# EAGLE design My Arduino Nano2 interface2 (EAGLE 5.10)
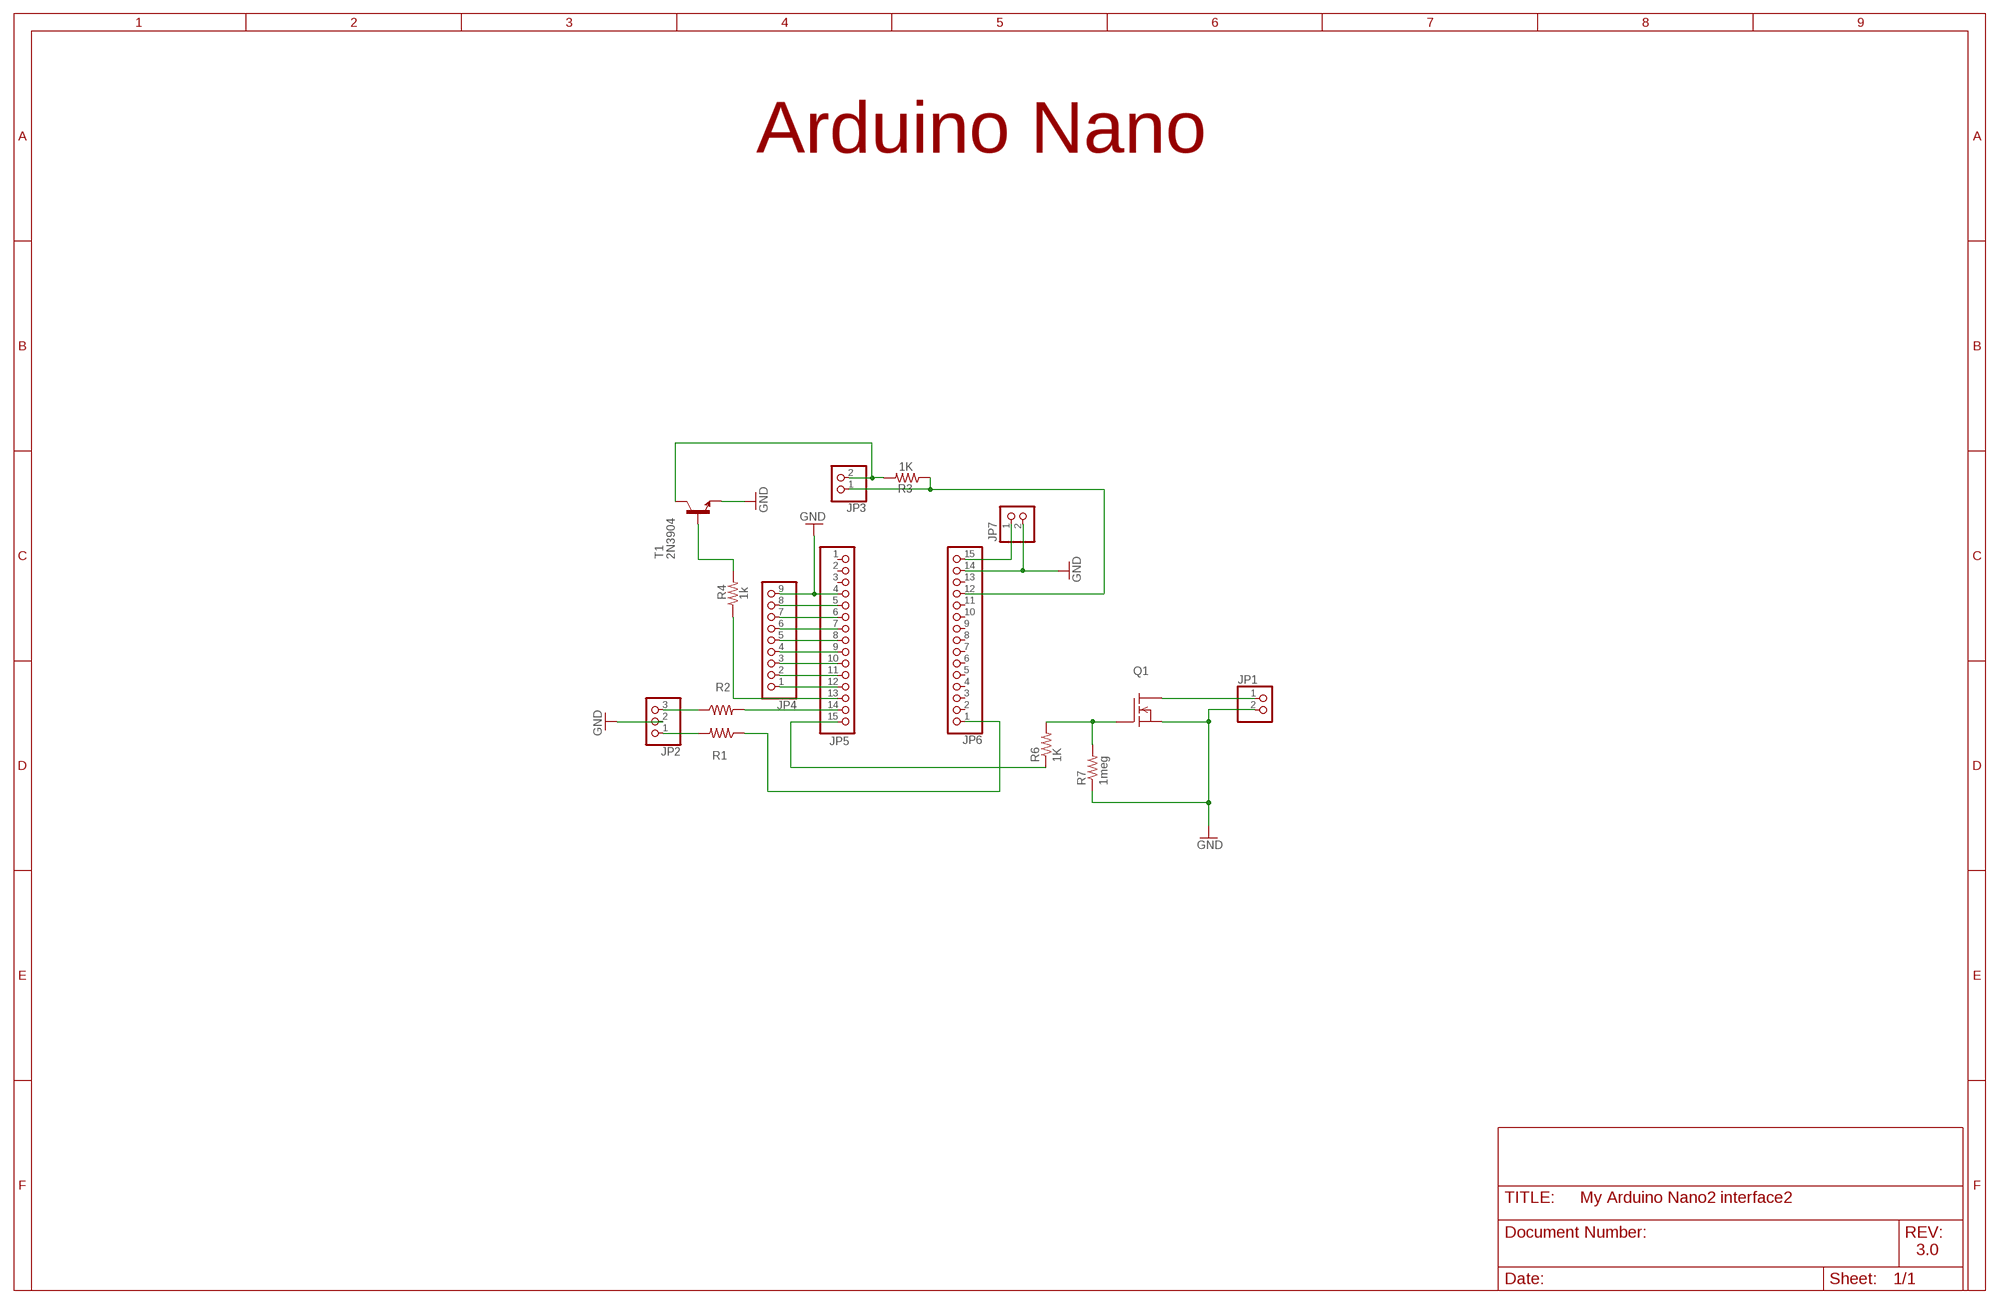
[diagram p0: schematic, sheet 1]

## Parts
JP1  PINHD-1X2  [1X02]
JP2  PINHD-1X3  [1X03]
JP3  PINHD-1X2  [1X02]
JP4  PINHD-1X9  [1X09]
JP5  PINHD-1X15  [1X15]
JP6  PINHD-1X15  [1X15]
JP7  PINHD-1X2  [1X02]
Q1  TN0602N3  [TO-92]
R1  R-US_0207/10  [0207/10]
R2  R-US_0207/10  [0207/10]
R3  1K  R-US_0207/10  [0207/10]
R4  1k  R-US_0207/10  [0207/10]
R6  1K  R-US_0207/10  [0207/10]
R7  1meg  R-US_0207/10  [0207/10]
T1  2N3904  [TO92]

## Nets
GND: JP1.2 JP2.2 JP4.9 JP5.4 JP6.14 JP7.2 Q1.1(S) R7.1 T1.3(E)
N$1: JP1.1 Q1.3(D)
N$2: JP2.3 R2.1
N$3: JP2.1 R1.2
N$4: JP6.1 R1.1
N$5: JP5.14 R2.2
N$6: R4.2 T1.2(B)
N$7: JP5.15 R6.1
N$8: Q1.2(G) R6.2 R7.2
N$9: JP3.1 JP6.12 R3.1
N$10: JP3.2 R3.2 T1.1(C)
N$11: JP5.13 R4.1
N$13: JP4.1 JP5.12
N$14: JP4.2 JP5.11
N$15: JP4.3 JP5.10
N$16: JP4.4 JP5.9
N$17: JP4.5 JP5.8
N$18: JP4.6 JP5.7
N$19: JP4.7 JP5.6
N$20: JP4.8 JP5.5
N$22: JP6.15 JP7.1
Unconnected: JP5.1 JP5.2 JP5.3 JP6.2 JP6.3 JP6.4 JP6.5 JP6.6 JP6.7 JP6.8 JP6.9 JP6.10 JP6.11 JP6.13

## Notes on the sheet
- Arduino Nano
- 3.0

## Library data of the parts
JP1 JP3 JP7 = pinhead:PINHD-1X2: PIN HEADER
JP2 = pinhead:PINHD-1X3: PIN HEADER
JP4 = pinhead:PINHD-1X9: PIN HEADER
JP5 JP6 = pinhead:PINHD-1X15: PIN HEADER
Q1 = transistor-fet:TN0602N3: N-Channel Enhancement MOSFET 20V; 4A; 0,75Ohm
R1-R4 R6 R7 = rcl:R-US_: RESISTOR, American symbol
T1 = transistor-neu-to92:2N3904: NPN TRANSISTOR

## Board
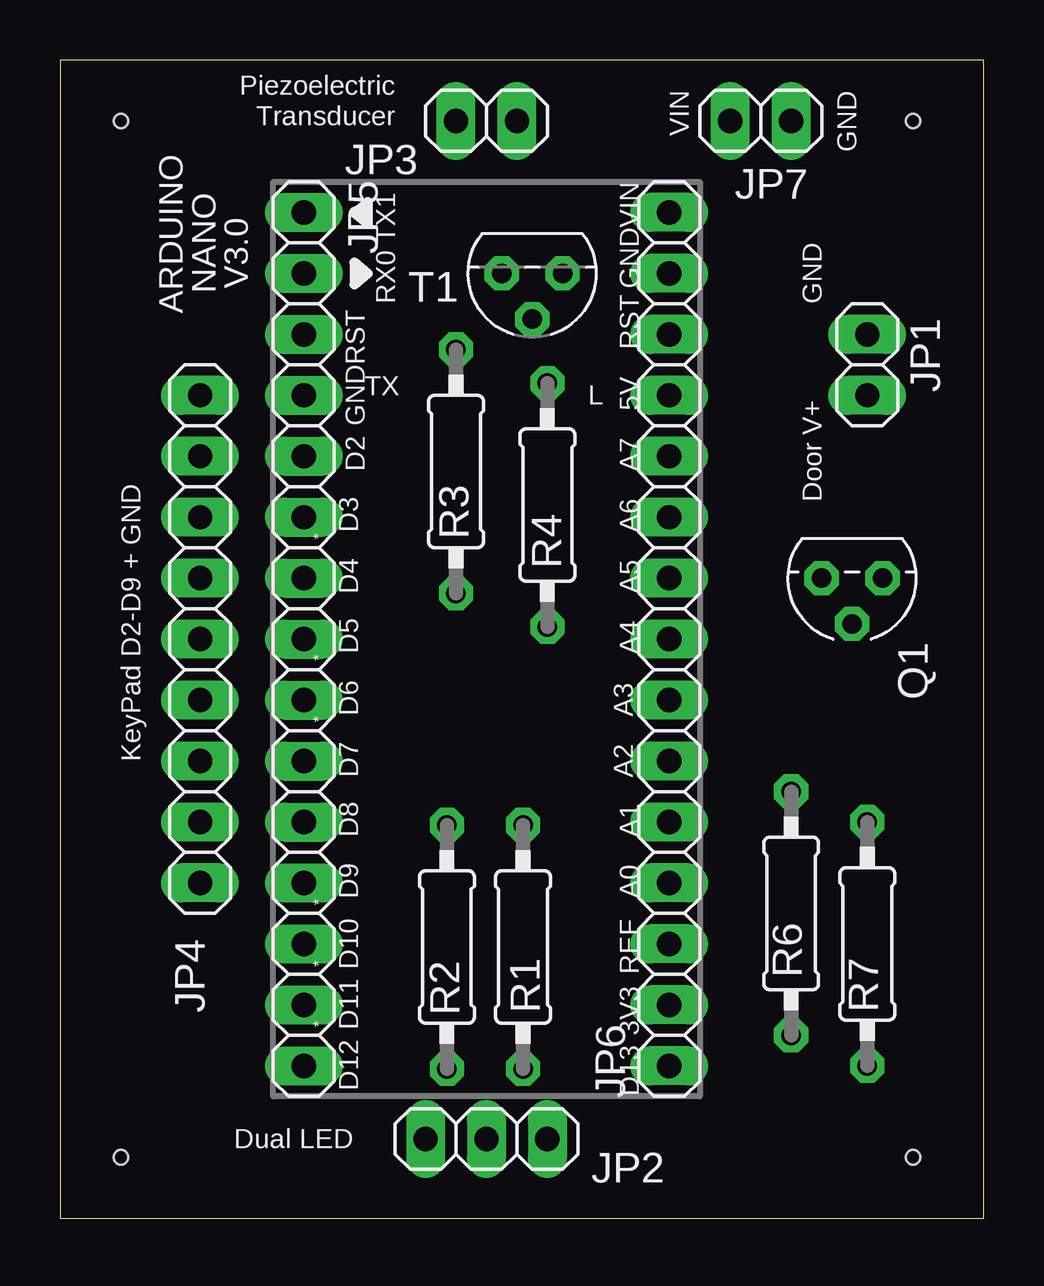
[diagram p1: board, top side]
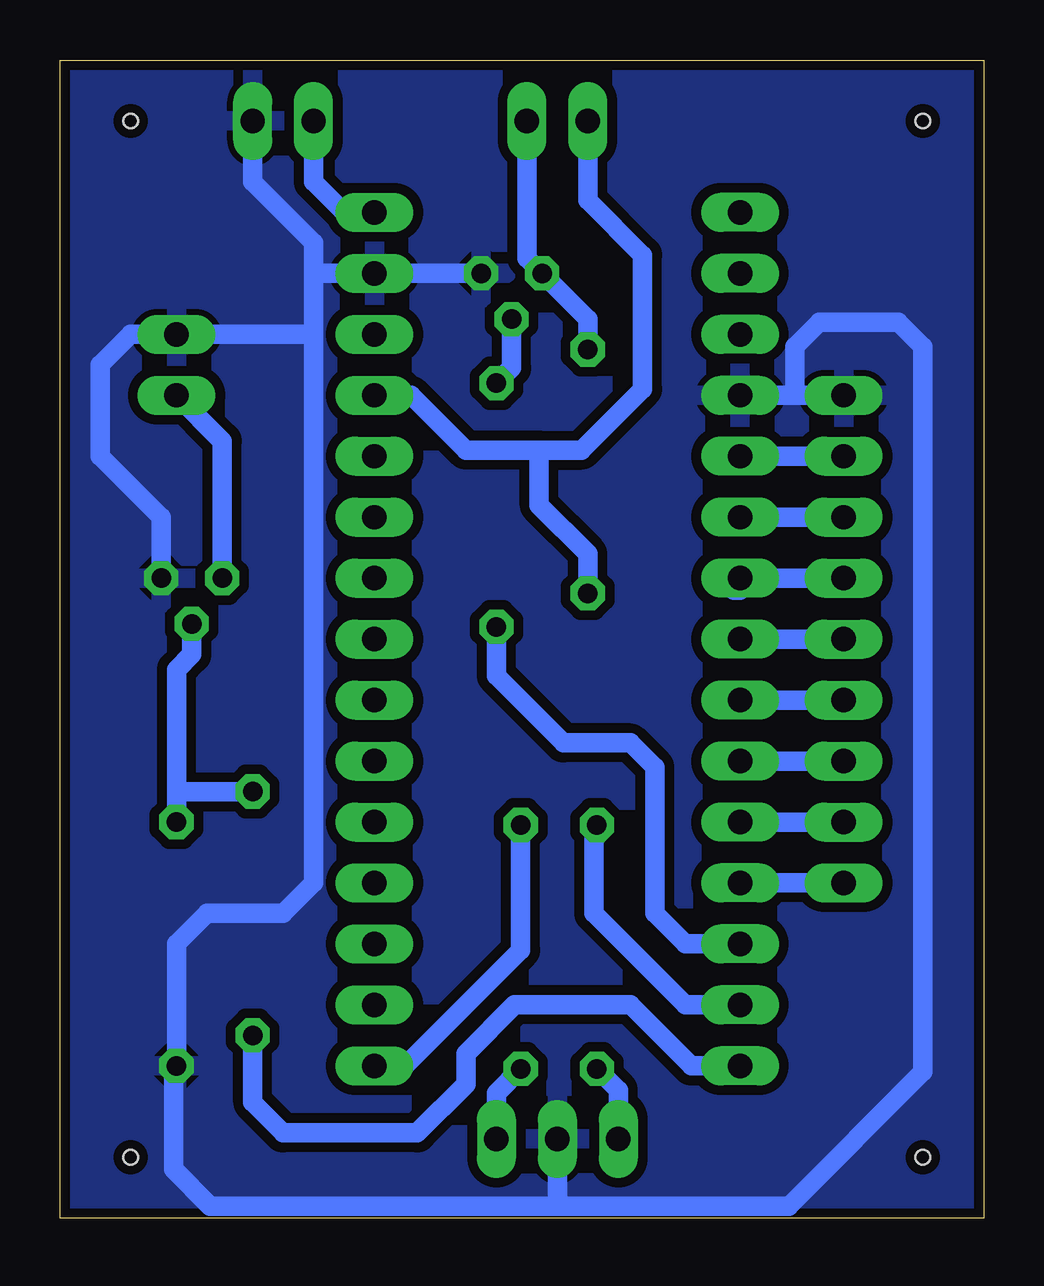
[diagram p2: board, bottom side, seen from below]

Size 38.51 x 48.26 mm. Coordinates in mm from the lower left corner, seen from the top.
Outline: 0,0 38.51,0 38.51,48.26 0,48.26 0,0
Copper layers (1*16): Top 0.035mm / dielectric 1.5mm / Bottom 0.035mm
Design rules "default *": minimum track width 8mil, minimum drill 16mil, track to track 8mil, track to pad 8mil, pad to pad 8mil, via to via 8mil, smd to smd 8mil, copper to edge 8mil, drill to drill 8mil, minimum pad ring 12mil, minimum via ring 8mil, stop-mask expansion 4mil, vias tented up to drill 18mil, thermal gap 10mil
Holes 0.6 mm at 2.54,45.72 2.54,2.54 35.56,2.54 35.56,45.72

### Footprints (pad centres in the part's own frame; a part is rotated, then mirrored left to right if it is on the bottom)
1X02 = drill 1.016 long: 1 -1.27,0; 2 1.27,0
1X03 = drill 1.016 long: 1 -2.54,0; 2 0,0; 3 2.54,0
1X09 = drill 1.016 long: 1 -10.16,0; 2 -7.62,0; 3 -5.08,0; 4 -2.54,0; 5 0,0; 6 2.54,0; 7 5.08,0; 8 7.62,0; 9 10.16,0
1X15 = drill 1.016 long: 1 -17.78,0; 2 -15.24,0; 3 -12.7,0; 4 -10.16,0; 5 -7.62,0; 6 -5.08,0; 7 -2.54,0; 8 0,0; 9 2.54,0; 10 5.08,0; 11 7.62,0; 12 10.16,0; 13 12.7,0; 14 15.24,0; 15 17.78,0
TO-92 = drill 0.813 octagon: 1 -1.27,0; 2 0,1.905; 3 1.27,0
0207/10 = drill 0.813 octagon: 1 -5.08,0; 2 5.08,0
TO92 = drill 0.813 octagon: 1 1.27,0; 2 0,1.905; 3 -1.27,0

### Placement (x,y rotation side)
JP1  33.66,35.56 90 top
JP2  17.78,3.3 180 top
JP3  17.78,45.72 0 top
JP4  5.84,24.13 90 top
JP5  10.16,24.13 270 top
JP6  25.4,24.13 90 top
JP7  29.21,45.72 0 top
Q1  33.02,26.67 180 top
R1  19.3,11.3 270 top
R2  16.13,11.3 90 top
R3  16.51,31.11 90 top
R4  20.32,29.72 90 top
R6  30.48,12.7 90 top
R7  33.66,11.43 90 top
T1  19.68,39.37 180 top

### Tracks (layer width: path | path; a pad name or v marks a point on that pad's centre or on a via)
GND
  Bottom 0.813: T1.3 JP6.14 27.94,39.37 | JP7.2 30.48,43.18 27.94,40.64 27.94,39.37 | 27.94,36.83 27.94,13.97 29.21,12.7 32.38,12.7 33.66,11.43 R7.1 33.78,6.22 33.78,2.03 32.26,0.51 17.53,0.51 | 27.94,36.83 JP1.2 35.56,36.83 36.83,35.56 36.83,31.75 34.29,29.21 Q1.1 | 27.94,36.83 27.94,39.37 | 7.87,34.29 JP4.9 | 7.87,34.29 JP5.4 | 7.87,34.29 7.87,36.32 6.86,37.34 3.56,37.34 2.54,36.32 2.54,6.1 8.13,0.51 17.53,0.51 | JP2.2 17.78,0.76 17.53,0.51
  pour Bottom (isolate 0.406): 0.51,48.26 38.61,48.26 38.61,-0.51 0.25,-0.51 0.25,48.26
N$1
  Bottom 0.813: Q1.3 31.75,32.38 JP1.1
N$2
  Bottom 0.813: JP2.3 15.24,5.33 R2.1
N$3
  Bottom 0.813: JP2.1 20.32,5.21 R1.2
N$4
  Bottom 0.813: R1.1 19.3,11.18 24.13,6.35 JP6.1
N$5
  Bottom 0.813: JP5.14 12.45,8.89 16.26,12.7 16.26,16.26 R2.2
N$6
  Bottom 0.813: T1.2 19.68,35.43 R4.2
N$7
  Bottom 0.813: JP5.15 12.19,6.35 14.73,8.89 19.56,8.89 21.59,6.86 21.59,5.59 23.62,3.56 29.21,3.56 30.48,4.83 R6.1
N$8
  Bottom 0.813: Q1.2 33.02,23.5 33.66,22.86 33.66,17.78 | R7.2 33.66,17.78 | 33.66,17.78 R6.2
N$9
  Bottom 0.813: JP3.1 16.51,42.42 14.22,40.13 14.22,34.54 16.76,32 18.54,32 | 18.54,32 21.59,32 23.88,34.29 JP6.12 | R3.1 16.51,27.69 18.54,29.72 18.54,32
N$10
  Bottom 0.813: JP3.2 19.05,40.01 T1.1 16.51,37.47 R3.2
N$11
  Bottom 0.813: JP5.13 12.45,11.43 13.72,12.7 13.72,18.8 14.73,19.81 17.53,19.81 20.32,22.61 R4.1
N$13
  Bottom 0.813: JP4.1 JP5.12
N$14
  Bottom 0.813: JP4.2 JP5.11
N$15
  Bottom 0.813: JP4.3 JP5.10
N$16
  Bottom 0.813: JP4.4 JP5.9
N$17
  Bottom 0.813: JP4.5 JP5.8
N$18
  Bottom 0.813: JP4.6 JP5.7 | JP5.7 10.41,26.67 10.41,26.16 10.16,26.16 JP5.7
N$19
  Bottom 0.813: JP4.7 JP5.6
N$20
  Bottom 0.813: JP4.8 JP5.5
N$22
  Bottom 0.813: JP6.15 26.67,41.91 27.94,43.18 JP7.1

### Text on the board
tPlace: Piezoelectric | VIN | GND | Transducer | TX1 | VIN | NANO | V3.0 | GND | ARDUINO | RX0 | GND | RST | RST | TX | L | 5V | GND | KeyPad D2-D9 + GND | D2 | A7 | Door V+ | D3 | A6 | * | D4 | A5 | D5 | * | A4 | * | D6 | A3 | D7 | A2 | D8 | A1 | * | D9 | A0 | * | D10 | REF | * | D11 | 3V3 | D12 | D13 | Dual LED